# EAGLE design Radio Board Rev A (EAGLE 8.3.2)
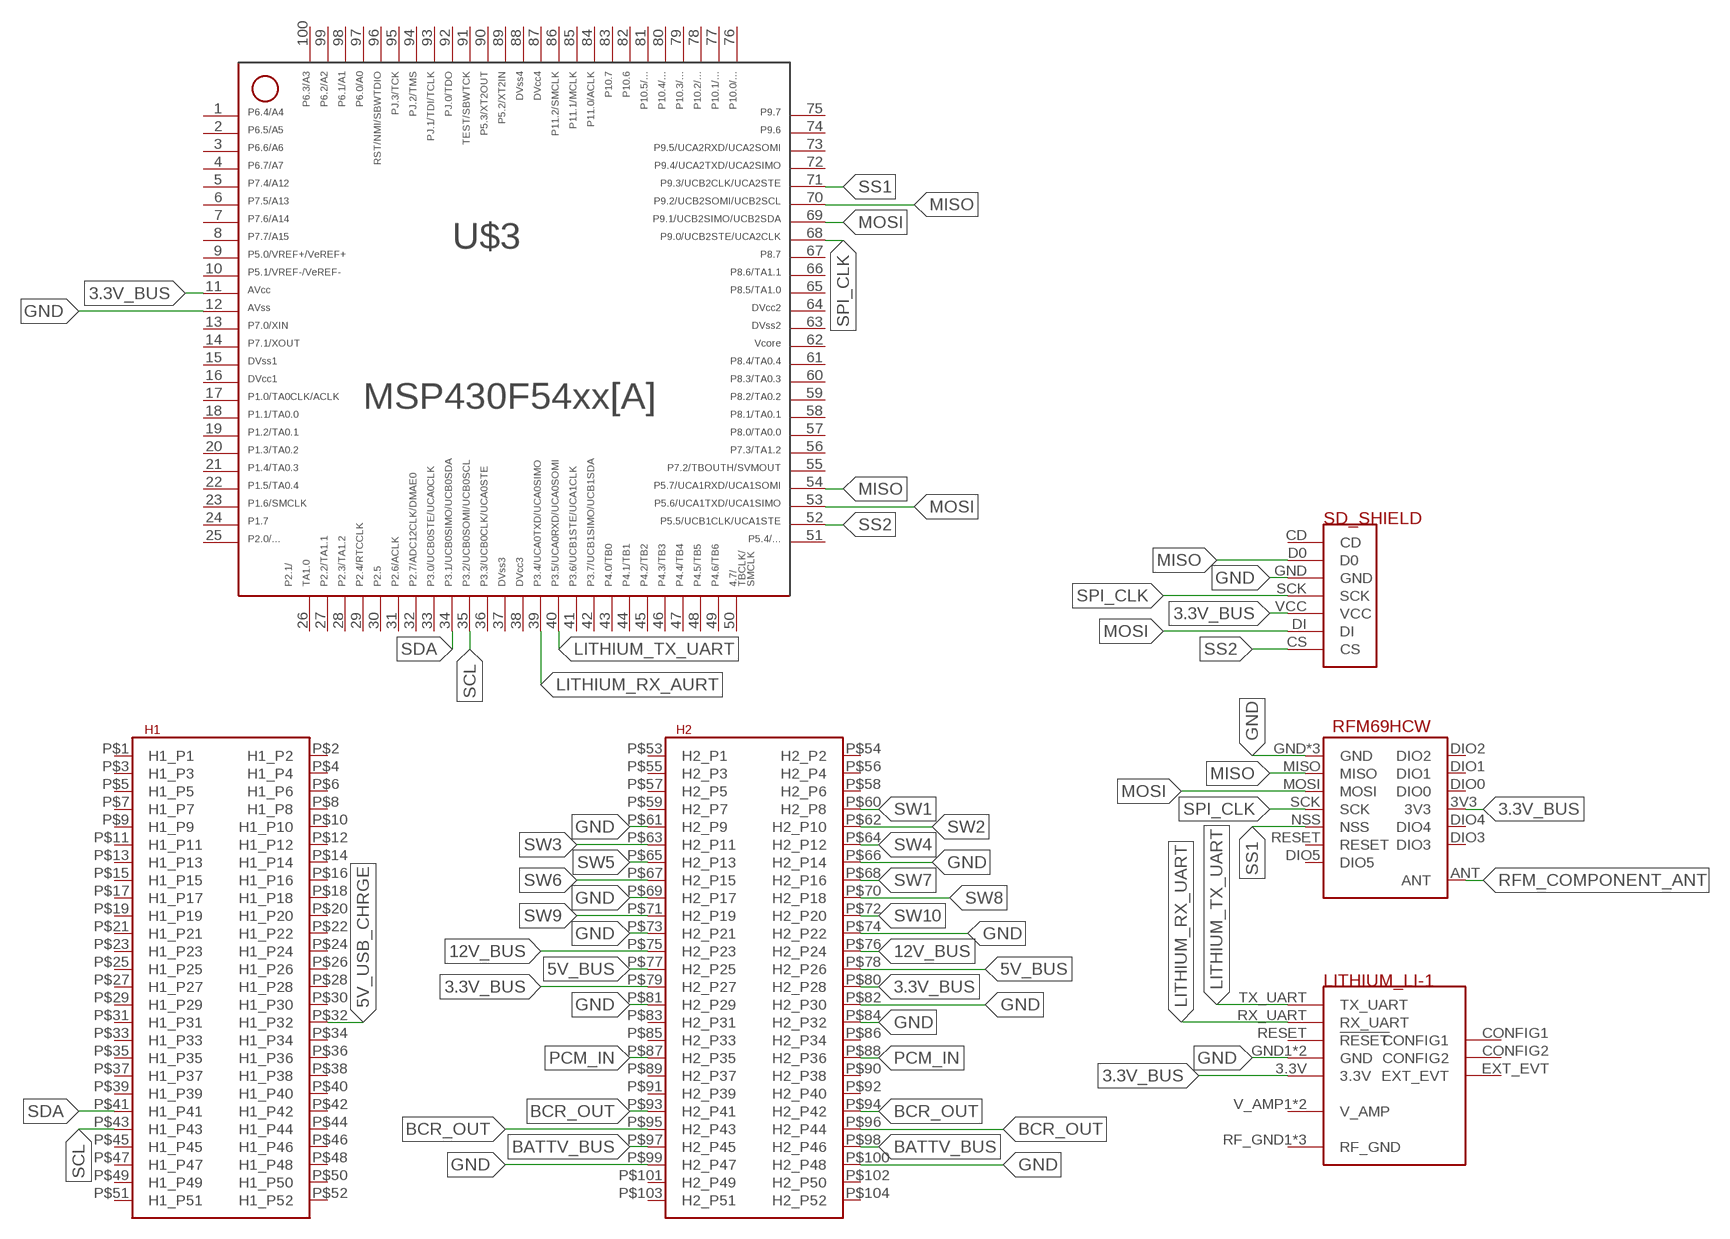
[diagram p0: schematic, sheet 1]

## Parts
U$1  LITHIUM  [LI-1]
U$2  PC104  [PC104]
U$3  MSP430F5438A  [PZ100]
U$4  RFM69HCWSMT  [RFM69HCW-SMT]
U$5  SD_SHIELD  [SD_SHIELD]

## Nets
3.3V_BUS: U$1.3.3V U$2.P$79(H2_P27) U$2.P$80(H2_P28) U$3.11 U$4.3V3 U$5.VCC
5V_BUS: U$2.P$77(H2_P25) U$2.P$78(H2_P26)
5V_USB_CHRGE: U$2.P$32(H1_P32)
12V_BUS: U$2.P$75(H2_P23) U$2.P$76(H2_P24)
BATTV_BUS: U$2.P$97(H2_P45) U$2.P$98(H2_P46)
BCR_OUT: U$2.P$93(H2_P41) U$2.P$94(H2_P42) U$2.P$95(H2_P43) U$2.P$96(H2_P44)
GND: U$1.GND1(GND) U$1.GND2(GND) U$2.P$61(H2_P9) U$2.P$66(H2_P14) U$2.P$69(H2_P17) U$2.P$73(H2_P21) U$2.P$74(H2_P22) U$2.P$81(H2_P29) U$2.P$82(H2_P30) U$2.P$84(H2_P32) U$2.P$99(H2_P47) U$2.P$100(H2_P48) U$3.12 U$4.GND U$4.GND@1(GND) U$4.GND@2(GND) U$5.GND
LITHIUM_RX_AURT: U$3.39
LITHIUM_RX_UART: U$1.RX_UART
LITHIUM_TX_UART: U$1.TX_UART U$3.40
MISO: U$3.54 U$3.70 U$4.MISO U$5.D0
MOSI: U$3.53 U$3.69 U$4.MOSI U$5.DI
PCM_IN: U$2.P$87(H2_P35) U$2.P$88(H2_P36)
RFM_COMPONENT_ANT: U$4.ANT
SCL: U$2.P$43(H1_P43) U$3.35
SDA: U$2.P$41(H1_P41) U$3.34
SPI_CLK: U$3.68 U$4.SCK U$5.SCK
SS1: U$3.71 U$4.NSS
SS2: U$3.52 U$5.CS
SW1: U$2.P$60(H2_P8)
SW2: U$2.P$62(H2_P10)
SW3: U$2.P$63(H2_P11)
SW4: U$2.P$64(H2_P12)
SW5: U$2.P$65(H2_P13)
SW6: U$2.P$67(H2_P15)
SW7: U$2.P$68(H2_P16)
SW8: U$2.P$70(H2_P18)
SW9: U$2.P$71(H2_P19)
SW10: U$2.P$72(H2_P20)
Unconnected: U$1.CONFIG1 U$1.CONFIG2 U$1.EXT_EVT U$1.RESET(!RESET) U$1.RF_GND1(RF_GND) U$1.RF_GND2(RF_GND) U$1.RF_GND3(RF_GND) U$1.V_AMP1(V_AMP) U$1.V_AMP2(V_AMP) U$2.P$1(H1_P1) U$2.P$2(H1_P2) U$2.P$3(H1_P3) U$2.P$4(H1_P4) U$2.P$5(H1_P5) U$2.P$6(H1_P6) U$2.P$7(H1_P7) U$2.P$8(H1_P8) U$2.P$9(H1_P9) U$2.P$10(H1_P10) U$2.P$11(H1_P11) U$2.P$12(H1_P12) U$2.P$13(H1_P13) U$2.P$14(H1_P14) U$2.P$15(H1_P15) U$2.P$16(H1_P16) U$2.P$17(H1_P17) U$2.P$18(H1_P18) U$2.P$19(H1_P19) U$2.P$20(H1_P20) U$2.P$21(H1_P21) U$2.P$22(H1_P22) U$2.P$23(H1_P23) U$2.P$24(H1_P24) U$2.P$25(H1_P25) U$2.P$26(H1_P26) U$2.P$27(H1_P27) U$2.P$28(H1_P28) U$2.P$29(H1_P29) U$2.P$30(H1_P30) U$2.P$31(H1_P31) U$2.P$33(H1_P33) U$2.P$34(H1_P34) U$2.P$35(H1_P35) U$2.P$36(H1_P36) U$2.P$37(H1_P37) U$2.P$38(H1_P38) U$2.P$39(H1_P39) U$2.P$40(H1_P40) U$2.P$42(H1_P42) U$2.P$44(H1_P44) U$2.P$45(H1_P45) U$2.P$46(H1_P46) U$2.P$47(H1_P47) U$2.P$48(H1_P48) U$2.P$49(H1_P49) U$2.P$50(H1_P50) U$2.P$51(H1_P51) U$2.P$52(H1_P52) U$2.P$53(H2_P1) U$2.P$54(H2_P2) U$2.P$55(H2_P3) U$2.P$56(H2_P4) U$2.P$57(H2_P5) U$2.P$58(H2_P6) U$2.P$59(H2_P7) U$2.P$83(H2_P31) U$2.P$85(H2_P33) U$2.P$86(H2_P34) U$2.P$89(H2_P37) U$2.P$90(H2_P38) U$2.P$91(H2_P39) U$2.P$92(H2_P40) U$2.P$101(H2_P49) U$2.P$102(H2_P50) U$2.P$103(H2_P51) U$2.P$104(H2_P52) U$3.1 U$3.2 U$3.3 U$3.4 U$3.5 U$3.6 U$3.7 U$3.8 U$3.9 U$3.10 U$3.13 U$3.14 U$3.17 U$3.18 U$3.19 U$3.20 U$3.21 U$3.22 U$3.23 U$3.24 U$3.25 U$3.26 U$3.27 U$3.28 U$3.29 U$3.30 U$3.31 U$3.32 U$3.33 U$3.36 U$3.41 U$3.42 U$3.43 U$3.44 U$3.45 U$3.46 U$3.47 U$3.48 U$3.49 U$3.50 U$3.51 U$3.55 U$3.56 U$3.57 U$3.58 U$3.59 U$3.60 U$3.61 U$3.65 U$3.66 U$3.67 U$3.72 U$3.73 U$3.74 U$3.75 U$3.76 U$3.77 U$3.78 U$3.79 U$3.80 U$3.81 U$3.82 U$3.83 U$3.84 U$3.85 U$3.86 U$3.89 U$3.90 U$3.91 U$3.92 U$3.93 U$3.94 U$3.95 U$3.96 U$3.97 U$3.98 U$3.99 U$3.100 U$4.DIO0 U$4.DIO1 U$4.DIO2 U$4.DIO3 U$4.DIO4 U$4.DIO5 U$4.RESET U$5.CD

## Power pins joined to a net without a drawn wire
15: U$3.15
16: U$3.16
37: U$3.37
38: U$3.38
62: U$3.62
63: U$3.63
64: U$3.64
87: U$3.87
88: U$3.88

## Library data of the parts
U$1 = Cubesat:LITHIUM
U$2 = Cubesat:PC104
U$3 = VT_Parts_Eagle:MSP430F5438A: ***MSP430F54xx***PZ100
U$4 = Cubesat:RFM69HCW
U$5 = VT_Parts_Eagle:SD_SHIELD

## Board
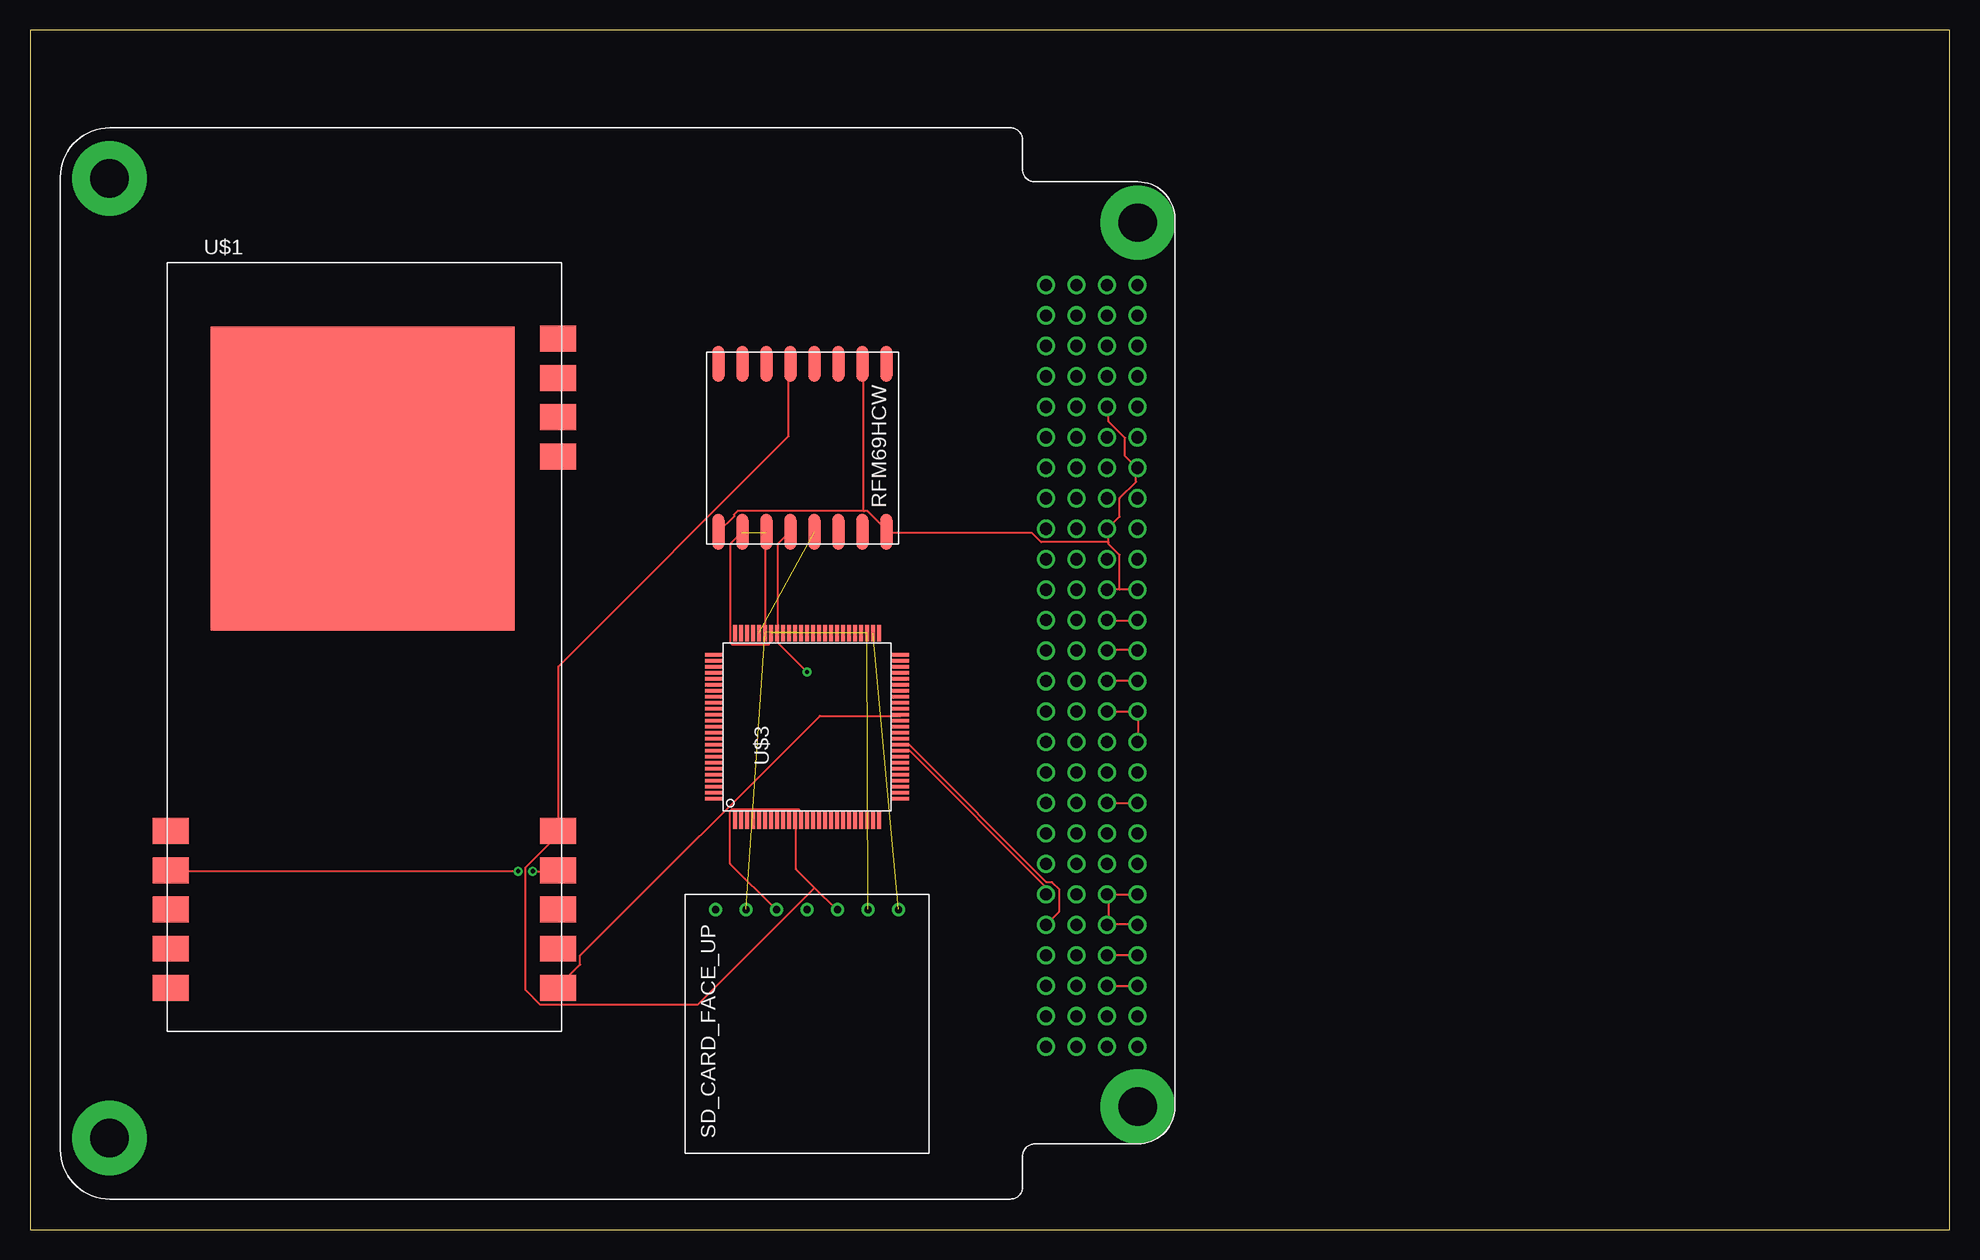
[diagram p1: board, top side]
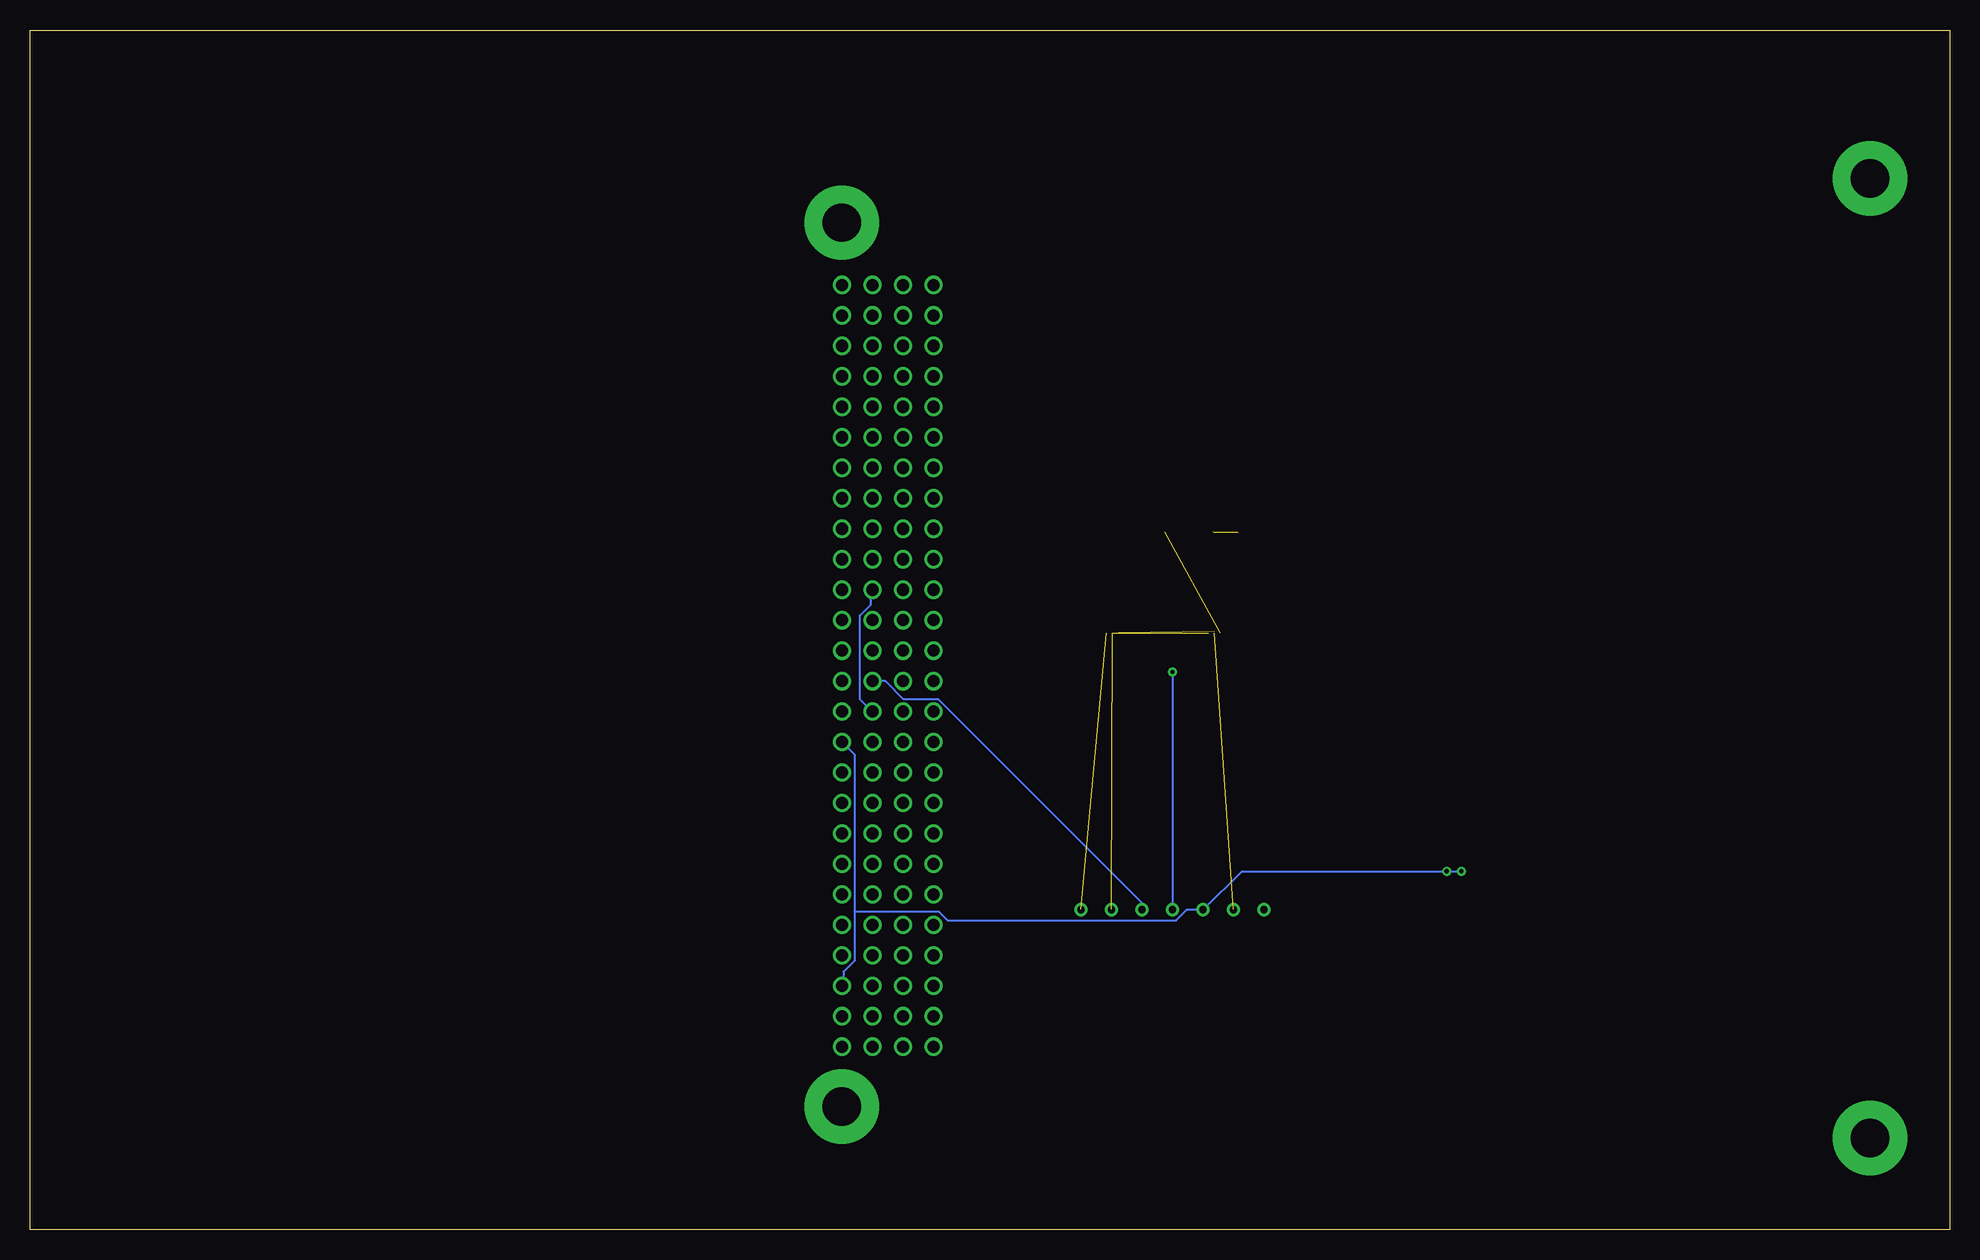
[diagram p2: board, bottom side, seen from below]

Size 160 x 100 mm. Coordinates in mm from the lower left corner, seen from the top.
Outline: 0,0 160,0 160,100 0,100 0,0
Copper layers (1*16): Top 0.035mm / dielectric 1.5mm / Bottom 0.035mm
Design rules "default": minimum track width 6mil, minimum drill 0.35mm, track to track 6mil, track to pad 6mil, pad to pad 6mil, via to via 6mil, smd to smd 6mil, copper to edge 40mil, drill to drill 6mil, minimum pad ring 10mil, minimum via ring 8mil, stop-mask expansion 4mil, vias tented up to drill 0mil, thermal gap 10mil

### Footprints (pad centres in the part's own frame; a part is rotated, then mirrored left to right if it is on the bottom)
LI-1 = smd 3 x 2.15: 3.3V 32.6,16.71; CONFIG1 0.3,3.63; CONFIG2 0.3,6.9; EXT_EVT 0.3,10.17; GND1 0.3,13.44; GND2 32.6,13.44; NC 0.3,16.71; RESET 32.6,10.17; RF_GND1 32.6,54.48; RF_GND2 32.6,57.75; RX_UART 32.6,6.9; TX_UART 32.6,3.63; V_AMP1 32.6,47.94; V_AMP2 32.6,51.21 | smd 25.35 x 25.35: RF_GND3 16.3,46.1
PC104 = drill 3.2 pad 6.2: MOUNT@1 4.1,85.1; MOUNT@2 4.1,5.1; MOUNT@3 89.8,81.4; MOUNT@4 89.8,7.7 | drill 1.016: P$1 82.151,76.2; P$2 84.691,76.2; P$3 82.151,73.66; P$4 84.691,73.66; P$5 82.151,71.12; P$6 84.691,71.12; P$7 82.151,68.58; P$8 84.691,68.58; P$9 82.151,66.04; P$10 84.691,66.04; P$11 82.151,63.5; P$12 84.691,63.5; P$13 82.151,60.96; P$14 84.691,60.96; P$15 82.151,58.42; P$16 84.691,58.42; P$17 82.151,55.88; P$18 84.691,55.88; P$19 82.151,53.34; P$20 84.691,53.34; P$21 82.151,50.8; P$22 84.691,50.8; P$23 82.151,48.26; P$24 84.691,48.26; P$25 82.151,45.72; P$26 84.691,45.72; P$27 82.151,43.18; P$28 84.691,43.18; P$29 82.151,40.64; P$30 84.691,40.64; P$31 82.151,38.1; P$32 84.691,38.1; P$33 82.151,35.56; P$34 84.691,35.56; P$35 82.151,33.02; P$36 84.691,33.02; P$37 82.151,30.48; P$38 84.691,30.48; P$39 82.151,27.94; P$40 84.691,27.94; P$41 82.151,25.4; P$42 84.691,25.4; P$43 82.151,22.86; P$44 84.691,22.86; P$45 82.151,20.32; P$46 84.691,20.32; P$47 82.151,17.78; P$48 84.691,17.78; P$49 82.151,15.24; P$50 84.691,15.24; P$51 82.151,12.7; P$52 84.691,12.7; P$53 87.231,76.2; P$54 89.771,76.2; P$55 87.231,73.66; P$56 89.771,73.66; P$57 87.231,71.12; P$58 89.771,71.12; P$59 87.231,68.58; P$60 89.771,68.58; P$61 87.231,66.04; P$62 89.771,66.04; P$63 87.231,63.5; P$64 89.771,63.5; P$65 87.231,60.96; P$66 89.771,60.96; P$67 87.231,58.42; P$68 89.771,58.42; P$69 87.231,55.88; P$70 89.771,55.88; P$71 87.231,53.34; P$72 89.771,53.34; P$73 87.231,50.8; P$74 89.771,50.8; P$75 87.231,48.26; P$76 89.771,48.26; P$77 87.231,45.72; P$78 89.771,45.72; P$79 87.231,43.18; P$80 89.771,43.18; P$81 87.231,40.64; P$82 89.771,40.64; P$83 87.231,38.1; P$84 89.771,38.1; P$85 87.231,35.56; P$86 89.771,35.56; P$87 87.231,33.02; P$88 89.771,33.02; P$89 87.231,30.48; P$90 89.771,30.48; P$91 87.231,27.94; P$92 89.771,27.94; P$93 87.231,25.4; P$94 89.771,25.4; P$95 87.231,22.86; P$96 89.771,22.86; P$97 87.231,20.32; P$98 89.771,20.32; P$99 87.231,17.78; P$100 89.771,17.78; P$101 87.231,15.24; P$102 89.771,15.24; P$103 87.231,12.7; P$104 89.771,12.7
PZ100 = smd 1.4 x 0.3: 1 -7.8,6; 2 -7.8,5.5; 3 -7.8,5; 4 -7.8,4.5; 5 -7.8,4; 6 -7.8,3.5; 7 -7.8,3; 8 -7.8,2.5; 9 -7.8,2; 10 -7.8,1.5; 11 -7.8,1; 12 -7.8,0.5; 13 -7.8,0; 14 -7.8,-0.5; 15 -7.8,-1; 16 -7.8,-1.5; 17 -7.8,-2; 18 -7.8,-2.5; 19 -7.8,-3; 20 -7.8,-3.5; 21 -7.8,-4; 22 -7.8,-4.5; 23 -7.8,-5; 24 -7.8,-5.5; 25 -7.8,-6; 51 7.8,-6; 52 7.8,-5.5; 53 7.8,-5; 54 7.8,-4.5; 55 7.8,-4; 56 7.8,-3.5; 57 7.8,-3; 58 7.8,-2.5; 59 7.8,-2; 60 7.8,-1.5; 61 7.8,-1; 62 7.8,-0.5; 63 7.8,0; 64 7.8,0.5; 65 7.8,1; 66 7.8,1.5; 67 7.8,2; 68 7.8,2.5; 69 7.8,3; 70 7.8,3.5; 71 7.8,4; 72 7.8,4.5; 73 7.8,5; 74 7.8,5.5; 75 7.8,6 | smd 0.3 x 1.4: 26 -6,-7.8; 27 -5.5,-7.8; 28 -5,-7.8; 29 -4.5,-7.8; 30 -4,-7.8; 31 -3.5,-7.8; 32 -3,-7.8; 33 -2.5,-7.8; 34 -2,-7.8; 35 -1.5,-7.8; 36 -1,-7.8; 37 -0.5,-7.8; 38 0,-7.8; 39 0.5,-7.8; 40 1,-7.8; 41 1.5,-7.8; 42 2,-7.8; 43 2.5,-7.8; 44 3,-7.8; 45 3.5,-7.8; 46 4,-7.8; 47 4.5,-7.8; 48 5,-7.8; 49 5.5,-7.8; 50 6,-7.8; 76 6,7.8; 77 5.5,7.8; 78 5,7.8; 79 4.5,7.8; 80 4,7.8; 81 3.5,7.8; 82 3,7.8; 83 2.5,7.8; 84 2,7.8; 85 1.5,7.8; 86 1,7.8; 87 0.5,7.8; 88 0,7.8; 89 -0.5,7.8; 90 -1,7.8; 91 -1.5,7.8; 92 -2,7.8; 93 -2.5,7.8; 94 -3,7.8; 95 -3.5,7.8; 96 -4,7.8; 97 -4.5,7.8; 98 -5,7.8; 99 -5.5,7.8; 100 -6,7.8
RFM69HCW-SMT = smd 3 x 1: 3V3 15,9; ANT 15,1; DIO0 15,11; DIO1 15,13; DIO2 15,15; DIO3 15,5; DIO4 15,7; DIO5 1,3; GND 15,3; GND@1 1,15; GND@2 1,1; MISO 1,13; MOSI 1,11; NSS 1,7; RESET 1,5; SCK 1,9
SD_SHIELD = drill 0.6: CD 20.32,17.78; CS 20.32,2.54; D0 20.32,15.24; DI 20.32,5.08; GND 20.32,12.7; SCK 20.32,10.16; VCC 20.32,7.62

### Placement (x,y rotation side)
U$1  11.43,16.51 0 top
U$2  2.54,2.54 0 top
U$3  64.77,41.91 90 top
U$4  72.39,57.15 90 top
U$5  74.93,6.35 90 top

### Tracks (layer width: path | path; a pad name or v marks a point on that pad's centre or on a via)
3.3V_BUS
  Top 0.152: U$2.P$80 U$2.P$79 | 65.38,28.5 67.21,26.67 U$5.VCC | 65.38,28.5 63.86,30.02 63.86,33.98 U$3.11 | 65.38,28.5 55.63,18.75 42.52,18.75 41.3,19.96 41.3,30.18 43.89,32.77 43.89,33.07 U$1.3.3V 44.04,33.22 44.04,46.94 63.25,66.14 63.25,72.08 U$4.3V3
  Bottom 0.152: U$2.P$79 88.7,45.72 87.17,44.2 84.28,44.2 67.36,27.28 67.36,26.67 U$5.VCC
5V_BUS
  Top 0.152: U$2.P$77 89.92,48.31 92.2,48.31 U$2.P$78
12V_BUS
  Top 0.152: U$2.P$75 89.92,50.75 92.2,50.75 U$2.P$76
BATTV_BUS
  Top 0.152: U$2.P$98 U$2.P$97
BCR_OUT
  Top 0.152: 89.92,25.45 92.2,25.45 U$2.P$96 | 89.92,27.89 92.2,27.89 U$2.P$94 | 89.92,27.89 89.92,25.45 | 89.92,25.45 U$2.P$95 | 89.92,27.89 U$2.P$93
GND  (via drill 0.35)
  Top 0.152: U$3.12 64.16,34.14 64.16,34.9 64.01,35.05 58.52,35.05 58.37,34.9 58.37,30.48 62.18,26.67 U$5.GND | v40.69,29.87 11.73,29.87 U$1.GND1 | v41.91,29.87 43.89,29.87 U$1.GND2 | 69.49,59.89 69.8,59.89 71.48,58.22 U$4.GND@2 71.48,58.06 83.52,58.06 84.28,57.3 89.92,57.3 | 69.49,59.89 58.98,59.89 58.67,59.59 58.67,59.44 57.45,58.22 U$4.GND@1 | 69.49,59.89 69.49,72.08 U$4.GND | U$2.P$74 90.83,53.34 | 90.83,53.34 U$2.P$73 | 89.92,57.3 89.92,57.15 90.83,56.24 90.83,53.34 | 89.92,57.3 89.92,58.37 U$2.P$69 89.92,58.52 90.83,59.44 90.83,60.96 92.2,62.33 92.2,63.4 U$2.P$66 92.2,63.55 91.29,64.47 91.29,65.99 89.92,67.36 89.92,68.58 U$2.P$61 | U$2.P$99 89.92,20.27 92.2,20.27 U$2.P$100 | U$2.P$81 89.92,43.13 92.2,43.13 U$2.P$82 92.35,43.13 92.35,40.69 U$2.P$84
  Bottom 0.152: v40.69,29.87 v41.91,29.87 58.98,29.87 62.18,26.67 U$5.GND 63.55,26.67 64.47,25.76 83.52,25.76 84.28,26.52 91.29,26.52 | 91.29,26.52 91.29,39.62 92.2,40.54 U$2.P$84 | 91.29,26.52 91.29,22.4 92.2,21.49 92.2,20.42 U$2.P$100 | U$2.P$73 89.92,53.34 89.92,52.12 90.83,51.21 90.83,44.2 89.92,43.28 U$2.P$81
LITHIUM_TX_UART
  Top 0.152: U$3.40 72.54,42.82 65.84,42.82 45.87,22.86 45.87,22.1 44.04,20.27 U$1.TX_UART
MISO  (3 unrouted)
  Top 0.152: 61.27,58.06 61.27,49.84 U$3.70
MOSI  (3 unrouted)
  Top 0.152: 59.28,58.06 58.37,57.15 58.37,48.92 58.52,48.77 61.57,48.77 61.72,48.92 61.72,49.68 U$3.69
PCM_IN
  Top 0.152: U$2.P$87 89.92,35.51 92.2,35.51 U$2.P$88
SCL
  Top 0.152: U$3.35 72.69,40.39 73.3,40.39 84.73,28.96 85.19,28.96 85.8,28.35 85.8,26.52 84.73,25.45 U$2.P$43
SDA
  Top 0.152: U$3.34 72.69,39.93 73.3,39.93 84.58,28.65 84.58,28.04 U$2.P$41
SPI_CLK  (via drill 0.35)
  Top 0.152: U$4.SCK 63.25,58.06 62.33,57.15 62.33,49.84 U$3.68 62.33,49.68 62.33,48.92 v64.77,46.48
  Bottom 0.152: v64.77,46.48 U$5.SCK
SS1  (1 unrouted)
SS2  (1 unrouted)